# EAGLE design proximity (EAGLE 8.4.1)
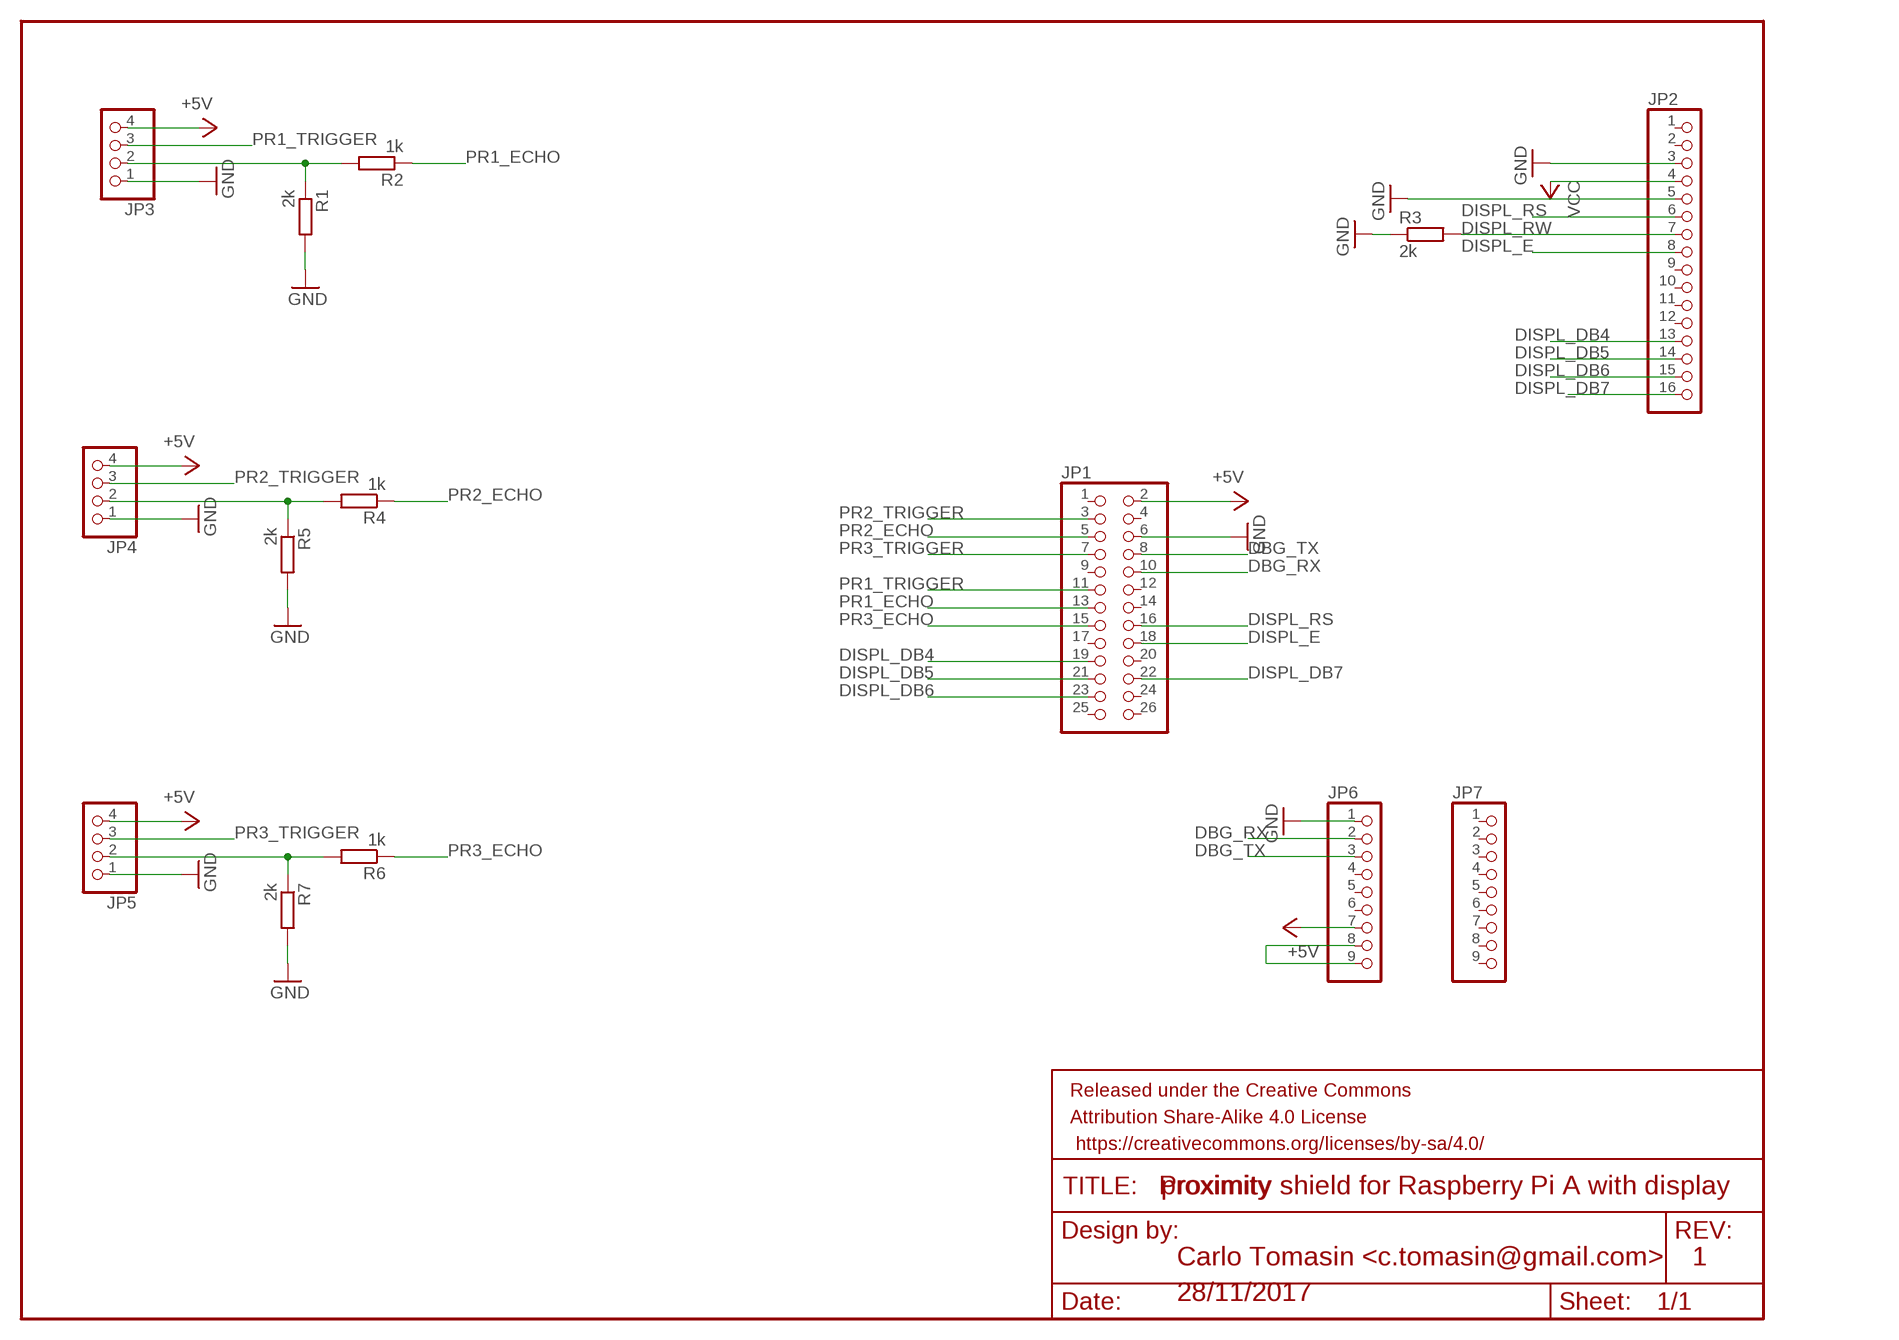
[diagram p0: schematic, sheet 1]

## Parts
FRAME1  FRAME-LETTER  [CREATIVE_COMMONS]
JP1  PINHD-2X13  [2X13]
JP2  PINHD-1X16  [1X16]
JP3  PINHD-1X4  [1X04]
JP4  PINHD-1X4  [1X04]
JP5  PINHD-1X4  [1X04]
JP6  PINHD-1X9  [1X09]
JP7  PINHD-1X9  [1X09]
R1  2k  R-EU_0204/7  [0204/7]
R2  1k  R-EU_0204/7  [0204/7]
R3  2k  R-EU_0204/7  [0204/7]
R4  1k  R-EU_0204/7  [0204/7]
R5  2k  R-EU_0204/7  [0204/7]
R6  1k  R-EU_0204/7  [0204/7]
R7  2k  R-EU_0204/7  [0204/7]

## Nets
+5V: JP1.2 JP3.4 JP4.4 JP5.4 JP6.7
DBG_RX: JP1.10 JP6.2
DBG_TX: JP1.8 JP6.3
DISPL_DB4: JP1.19 JP2.13
DISPL_DB5: JP1.21 JP2.14
DISPL_DB6: JP1.23 JP2.15
DISPL_DB7: JP1.22 JP2.16
DISPL_E: JP1.18 JP2.8
DISPL_RS: JP1.16 JP2.6
DISPL_RW: JP2.7 R3.2
GND: JP1.6 JP2.3 JP2.5 JP3.1 JP4.1 JP5.1 JP6.1 R1.2 R3.1 R5.2 R7.2
N$1: JP3.2 R1.1 R2.2
N$2: JP4.2 R4.2 R5.1
N$3: JP5.2 R6.2 R7.1
N$10: JP6.8 JP6.9
PR1_ECHO: JP1.13 R2.1
PR1_TRIGGER: JP1.11 JP3.3
PR2_ECHO: JP1.5 R4.1
PR2_TRIGGER: JP1.3 JP4.3
PR3_ECHO: JP1.15 R6.1
PR3_TRIGGER: JP1.7 JP5.3
VCC: JP2.4
Unconnected: JP1.1 JP1.4 JP1.9 JP1.12 JP1.14 JP1.17 JP1.20 JP1.24 JP1.25 JP1.26 JP2.1 JP2.2 JP2.9 JP2.10 JP2.11 JP2.12 JP6.4 JP6.5 JP6.6 JP7.1 JP7.2 JP7.3 JP7.4 JP7.5 JP7.6 JP7.7 JP7.8 JP7.9

## Notes on the sheet
- Proximity shield for Raspberry Pi A with display
- Carlo Tomasin <c.tomasin@gmail.com> | 1
- 28/11/2017

## Library data of the parts
FRAME1 = SparkFun-Aesthetics:FRAME-LETTER: Schematic Frame - Letter Standard 8.5x11 US Letter frame
JP1 = pinhead:PINHD-2X13: PIN HEADER
JP2 = pinhead:PINHD-1X16: PIN HEADER
JP3-JP5 = pinhead:PINHD-1X4: PIN HEADER
JP6 JP7 = pinhead:PINHD-1X9: PIN HEADER
R1-R7 = resistor:R-EU_: RESISTOR, European symbol

## Board
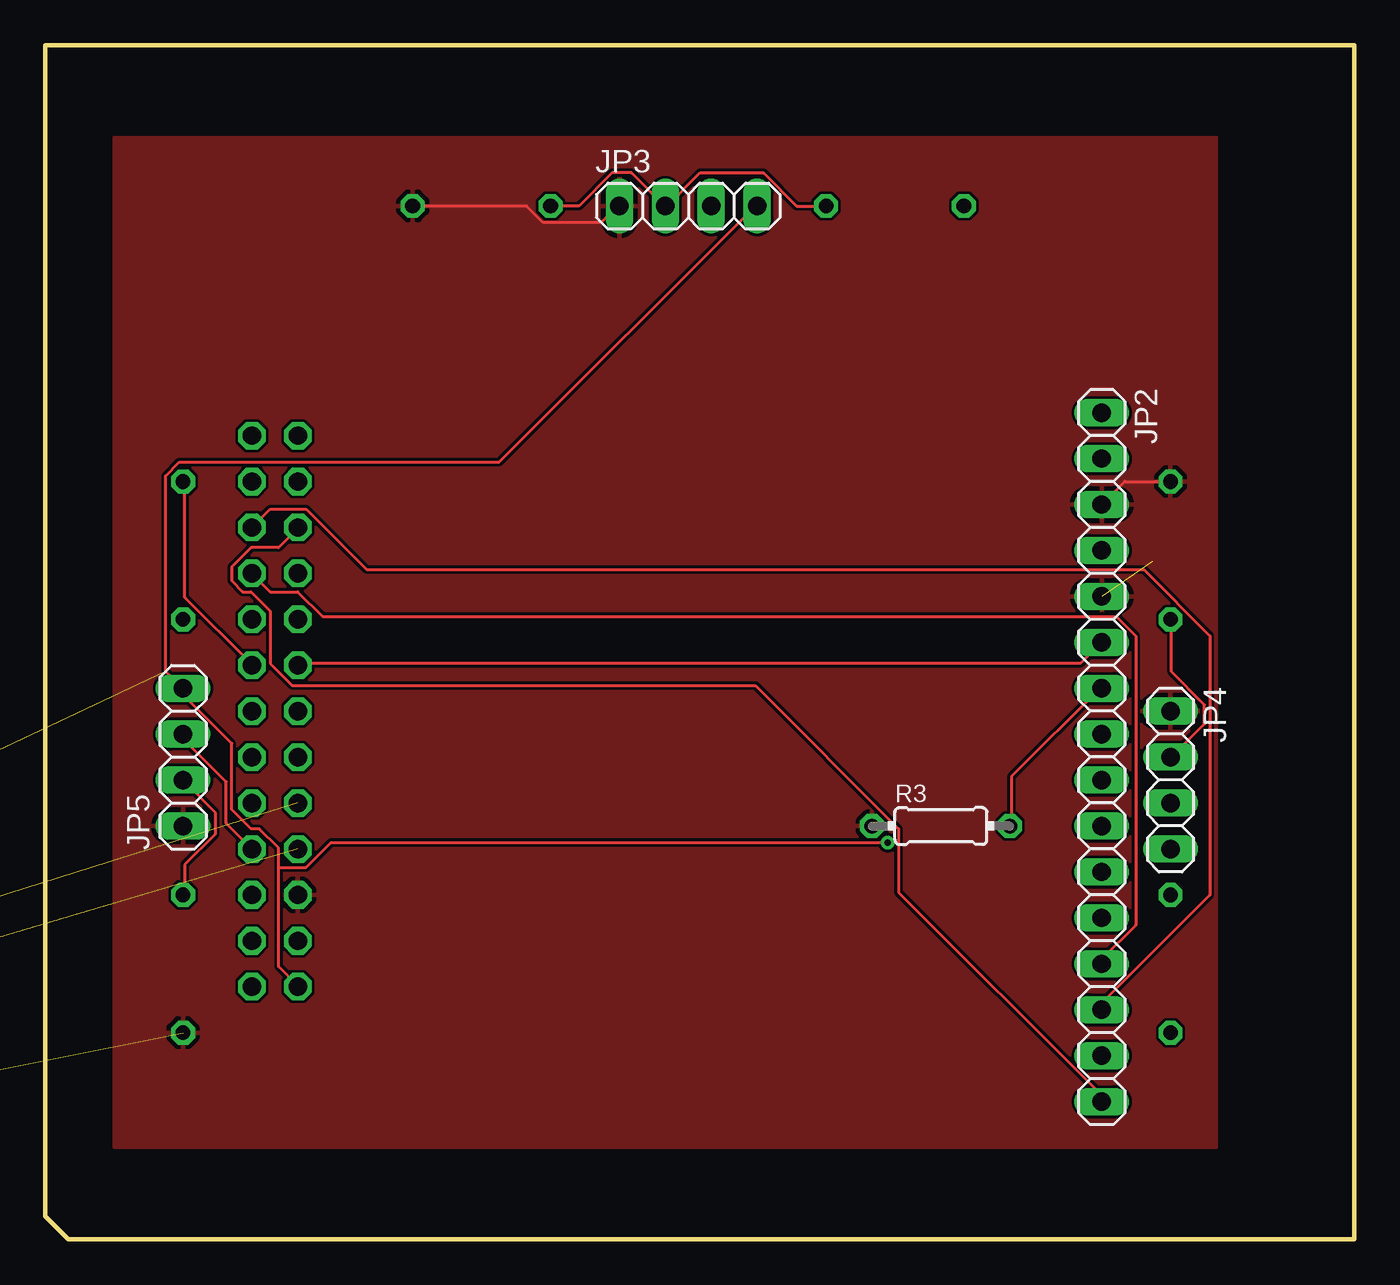
[diagram p1: board, top side]
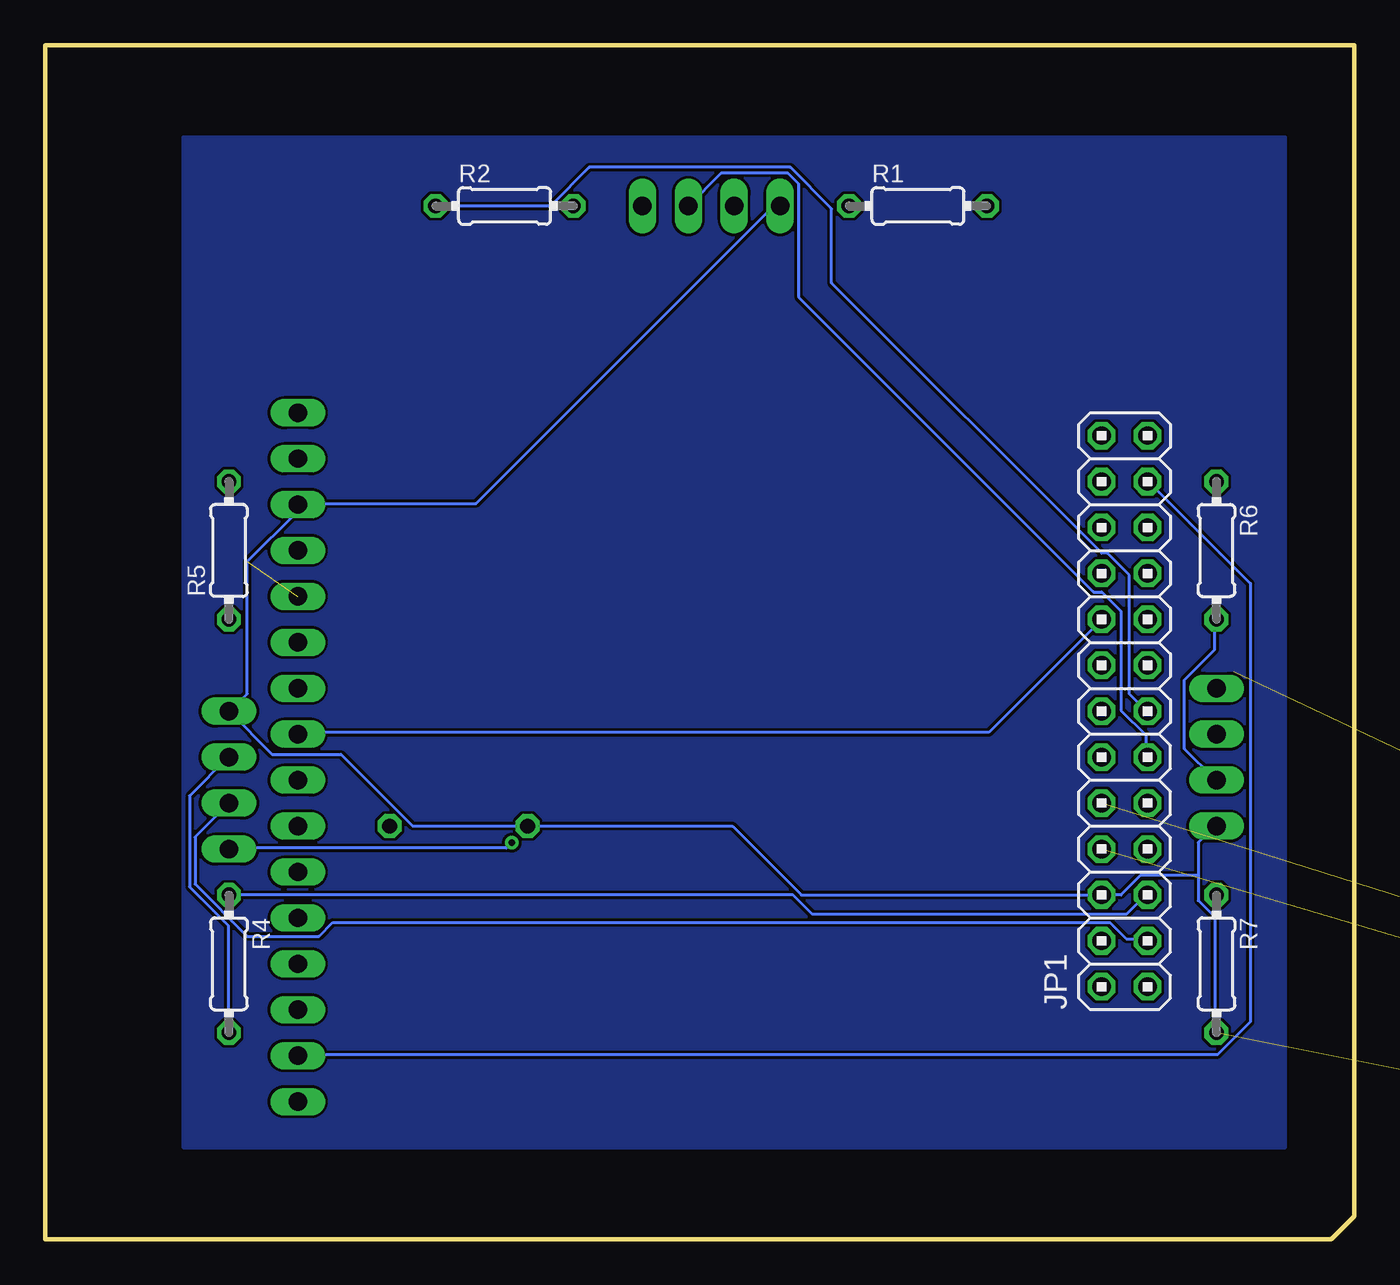
[diagram p2: board, bottom side, seen from below]

Size 72.39 x 66.04 mm. Coordinates in mm from the lower left corner, seen from the top.
Outline: 0,66.04 72.39,66.04 72.39,0 1.27,0 0,1.27 0,66.04
Copper layers (1*16): Top 0.035mm / dielectric 1.5mm / Bottom 0.035mm
Design rules "default": minimum track width 6mil, minimum drill 0.35mm, track to track 6mil, track to pad 6mil, pad to pad 6mil, via to via 6mil, smd to smd 6mil, copper to edge 40mil, drill to drill 6mil, minimum pad ring 10mil, minimum via ring 8mil, stop-mask expansion 4mil, vias tented up to drill 0mil, thermal gap 10mil

### Footprints (pad centres in the part's own frame; a part is rotated, then mirrored left to right if it is on the bottom)
2X13 = drill 1.016 octagon: 1 -15.24,-1.27; 2 -15.24,1.27; 3 -12.7,-1.27; 4 -12.7,1.27; 5 -10.16,-1.27; 6 -10.16,1.27; 7 -7.62,-1.27; 8 -7.62,1.27; 9 -5.08,-1.27; 10 -5.08,1.27; 11 -2.54,-1.27; 12 -2.54,1.27; 13 0,-1.27; 14 0,1.27; 15 2.54,-1.27; 16 2.54,1.27; 17 5.08,-1.27; 18 5.08,1.27; 19 7.62,-1.27; 20 7.62,1.27; 21 10.16,-1.27; 22 10.16,1.27; 23 12.7,-1.27; 24 12.7,1.27; 25 15.24,-1.27; 26 15.24,1.27
1X16 = drill 1.016 long: 1 -19.05,0; 2 -16.51,0; 3 -13.97,0; 4 -11.43,0; 5 -8.89,0; 6 -6.35,0; 7 -3.81,0; 8 -1.27,0; 9 1.27,0; 10 3.81,0; 11 6.35,0; 12 8.89,0; 13 11.43,0; 14 13.97,0; 15 16.51,0; 16 19.05,0
1X04 = drill 1.016 long: 1 -3.81,0; 2 -1.27,0; 3 1.27,0; 4 3.81,0
1X09 = drill 1.016 long: 1 -10.16,0; 2 -7.62,0; 3 -5.08,0; 4 -2.54,0; 5 0,0; 6 2.54,0; 7 5.08,0; 8 7.62,0; 9 10.16,0
0204/7 = drill 0.813 octagon: 1 -3.81,0; 2 3.81,0

### Placement (x,y rotation side)
FRAME1  -81.28,13.97 0 top  (outside the outline)
JP1  12.7,29.21 90 bottom
JP2  58.42,26.67 270 top
JP3  35.56,57.15 0 top
JP4  62.23,25.4 270 top
JP5  7.62,26.67 90 top
JP6  -83.82,-8.89 0 top  (outside the outline)
JP7  -83.82,-24.13 0 top  (outside the outline)
R1  24.13,57.15 0 bottom
R2  46.99,57.15 0 bottom
R3  49.53,22.86 0 top
R4  62.23,15.24 270 bottom
R5  62.23,38.1 90 bottom
R6  7.62,38.1 270 bottom
R7  7.62,15.24 270 bottom

### Tracks (layer width: path | path; a pad name or v marks a point on that pad's centre or on a via)
+5V  (via drill 0.35)  (1 unrouted)
  Top 0.152: 12.9,20.57 12.9,15.09 13.97,14.02 JP1.2 | 12.9,20.57 12.9,21.64 11.84,22.71 11.38,22.71 10.31,23.77 10.31,27.43 7.72,30.02 7.72,30.48 JP5.4 7.57,30.48 6.65,31.39 6.65,42.22 7.42,42.98 25.09,42.98 39.27,57.15 JP3.4 | v46.58,21.95 15.8,21.95 14.43,20.57 12.9,20.57
  Bottom 0.152: v46.58,21.95 46.89,21.64 62.13,21.64 JP4.4
DBG_RX  (1 unrouted)
DBG_TX  (1 unrouted)
DISPL_DB4
  Top 0.152: JP1.19 12.45,35.81 13.97,35.81 15.34,34.44 59.23,34.44 60.3,33.38 60.3,17.37 58.47,15.55 58.47,15.24 JP2.13
DISPL_DB5
  Top 0.152: JP1.21 12.45,40.39 14.43,40.39 17.78,37.03 60.76,37.03 64.41,33.38 64.41,19.05 58.47,13.11 58.47,12.8 JP2.14
DISPL_DB6
  Bottom 0.152: JP2.15 58.32,10.21 7.57,10.21 5.74,12.04 5.74,36.27 11.38,41.91 JP1.23
DISPL_DB7
  Top 0.152: JP2.16 58.32,7.62 58.32,8.08 47.19,19.2 47.19,22.71 39.27,30.63 13.67,30.63 12.45,31.85 12.45,34.75 11.38,35.81 10.92,35.81 10.31,36.42 10.31,37.19 11.38,38.25 12.9,38.25 13.97,39.32 JP1.22
DISPL_E
  Bottom 0.152: JP1.18 20.22,28.04 58.32,28.04 JP2.8
DISPL_RS
  Top 0.152: JP2.6 57.25,31.85 13.97,31.85 JP1.16
DISPL_RW
  Top 0.152: R3.2 53.44,22.86 53.44,25.6 58.32,30.48 JP2.7
GND  (2 unrouted)
  Top 0.152: R1.2 26.62,57.15 27.53,56.24 30.73,56.24 31.65,57.15 JP3.1 | R5.2 59.69,41.91 JP2.3
  Bottom 0.152: 8.64,20.12 8.64,21.95 7.72,22.86 JP5.1 | 8.64,20.12 8.64,18.75 7.72,17.83 7.72,11.43 R7.2 | 8.64,20.12 11.84,20.12 12.9,19.05 JP1.6 30.58,19.05 34.39,22.86 R3.1 52.07,22.86 56.03,26.82 59.84,26.82 JP4.1 62.13,29.26 61.21,30.17 61.21,37.49 58.47,40.23 58.47,40.54 JP2.3 58.32,40.69 48.56,40.69 32.11,57.15 JP3.1
  pour Top: 3.81,8.89 3.81,60.96 64.77,60.96 64.77,5.08 3.81,5.08
N$1
  Top 0.152: R1.1 29.52,57.15 31.34,58.98 32.41,58.98 34.24,57.15 JP3.2 34.39,57.15 36.22,58.98 39.73,58.98 41.55,57.15 R2.2
N$2
  Top 0.152: R5.1 62.28,34.29 62.28,31.39 64.11,29.57 64.11,28.5 62.28,26.67 JP4.2
  Bottom 0.152: R4.2 62.28,11.43 62.28,17.37 64.41,19.51 64.41,24.54 62.28,26.67 JP4.2
N$3
  Top 0.152: JP5.2 9.4,23.62 9.4,22.4 7.72,20.73 7.72,19.05 R7.1
  Bottom 0.152: R6.2 7.72,34.29 7.72,32.61 9.4,30.94 9.4,27.13 7.72,25.45 JP5.2
N$4
  pour Bottom: 3.81,60.96 64.77,60.96 64.77,5.08 3.81,5.08
N$5
  pour Bottom: 3.81,60.96 3.81,5.08 64.77,5.08 64.77,60.96
N$10  (1 unrouted)
PR1_ECHO
  Bottom 0.152: R2.1 44.45,57.15 42.32,59.28 31.19,59.28 28.91,57 28.91,52.88 13.97,37.95 13.67,37.95 12.45,36.73 12.45,30.17 11.53,29.26 JP1.13
PR1_TRIGGER
  Bottom 0.152: JP3.3 35,58.98 31.34,58.98 30.73,58.37 30.73,52.12 14.43,35.81 13.97,35.81 12.9,34.75 12.9,29.26 11.53,27.89 11.53,26.67 JP1.11
PR2_ECHO
  Bottom 0.152: R4.1 31.04,19.05 29.97,17.98 12.6,17.98 11.53,19.05 JP1.5
PR2_TRIGGER
  Bottom 0.152: JP4.3 64.11,22.25 64.11,19.66 61.21,16.76 57.25,16.76 56.49,17.53 13.51,17.53 12.6,16.61 11.53,16.61 JP1.3
PR3_ECHO
  Top 0.152: R6.1 7.72,41.91 7.72,35.51 11.38,31.85 JP1.15
PR3_TRIGGER
  Top 0.152: JP1.7 10.01,23.01 10.01,25.3 7.72,27.58 7.72,27.89 JP5.3